# EasyEDA schematic SCH_N20电动螺丝刀_2022-09-17.json
TITLE: n20电动螺丝刀; REV: 0.1; Date: 2022-09-13; Sheet: 1/1; Drawn By: 0321cwb; Company: Your Company
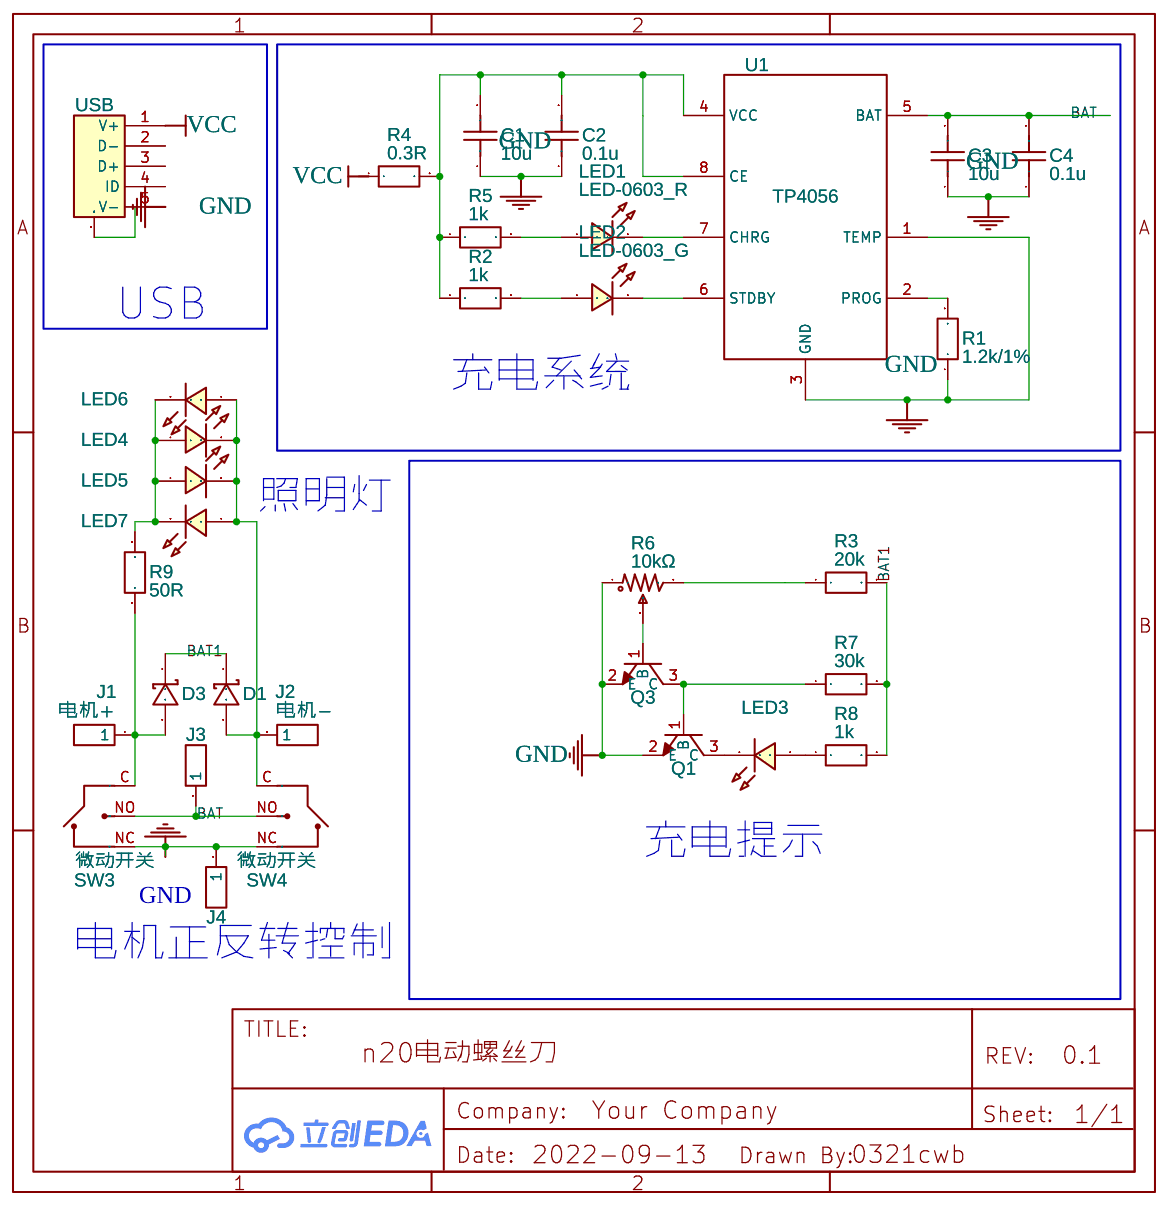
[diagram p0: schematic sheet]

## Parts
C1  10u  [C0603]
C2  0.1u  [C0603]
C3  10u  [C0603]
C4  0.1u  [C0603]
D1  1N5817WS  [SOD-323_L1.8-W1.3-LS2.5-RD]
D3  1N5817WS  [SOD-323_L1.8-W1.3-LS2.5-RD]
J1  电机+  [HDR-M-2.54_1X1]
J2  电机-  [HDR-M-2.54_1X1]
J3  HDR-M-2.54_1x1  [HDR-M-2.54_1X1]
J4  HDR-M-2.54_1x1  [HDR-M-2.54_1X1]
LED1  LED-0603_R  [LED0603_RED]
LED2  LED-0603_G  [LED0603_GREEN]
LED3  LED-0603_R  [LED0603_RED]
LED4  LED-0603_R  [LED0603_RED]
LED5  LED-0603_R  [LED0603_RED]
LED6  LED-0603_R  [LED0603_RED]
LED7  LED-0603_R  [LED0603_RED]
Q1  S8050_C2926165  [SOT-23-3_L2.9-W1.3-P1.90-LS2.4-BR]
Q3  S8050_C2926165  [SOT-23-3_L2.9-W1.3-P1.90-LS2.4-BR]
R1  1.2k/1%  [R0603]
R2  1k  [R0603]
R3  20k  [R0603]
R4  0.3R  [R0603]
R5  1k  [R0603]
R6  10kΩ  [RES-ADJ-SMD_3P-L3.0-W3.8-P1.75-BR]
R7  30k  [R0603]
R8  1k  [R0603]
R9  50R  [R0603]
SW3  微动开关  [SW-TH_DEALON_LF-108]
SW4  微动开关  [SW-TH_DEALON_LF-108]
U1  TP4056  [SOP8_150MIL_JX]
USB  micro 5PFour-legged board7.2There is a column card point0.4m  [MICRO-USB-SMD_5P-P0.65-H-F-C40943]

## Library data of the parts
C1-C4 = C_0603_US: Contributor: LCEDA_Lib
D1 D3 = 1N5817WS: Supplier: LCSC; Supplier Part: C489146; Manufacturer: KEXIN; Contributor: LCSC; JLCPCB Part Class: Extended Part
J1-J4 = HDR-M-2.54_1x1: Supplier Part: C81276; Supplier: LCSC; Contributor: LCEDA_Lib
LED1 LED3-LED7 = LED-0603_R: Manufacturer: EVERLIGHT(台湾亿光); Manufacturer Part: 19-217/R6C-AL1M2VY/3T; Supplier Part: C72044; Supplier: LCSC; Contributor: LCEDA_01
LED2 = LED-0603_G: Manufacturer: EVERLIGHT(台湾亿光); Manufacturer Part: 19-217/GHC-YR1S2/3T; Supplier Part: C72043; Supplier: LCSC; Contributor: LCEDA_Lib
Q1 Q3 = S8050_C2926165: Supplier: LCSC; Supplier Part: C2926165; Manufacturer: FOSAN(富信); Manufacturer Part: S8050; Contributor: LCSC; JLCPCB Part Class: Extended Part
R1-R5 R7-R9 = R_0603_EU: Contributor: LCEDA_Lib
R6 = TC33X-2-103E: Supplier: LCSC; Supplier Part: C719176; Manufacturer: BOURNS; Contributor: LCSC; JLCPCB Part Class: Extended Part
SW3 SW4 = LF-108: Supplier: LCSC; Supplier Part: C2914466; Manufacturer: DEALON(德艺隆); Contributor: LCSC
U1 = -: Supplier: LCSC
USB = micro 5PFour-legged board7.2There is a column card point0.4m: Supplier: LCSC; Manufacturer: ValuePro; image: //image.lceda.cn/szlcsc/C40943.jpg; Supplier Part: C40943

## Nets
GND: C1.1 C2.1 C3.1 C4.1 J4.1 Q1.2(E) Q3.2(E) R1.1 R6.1 SW3.NC SW4.NC U1.1(TEMP) U1.3(GND) USB.5(V-)
VCC: R4.1 USB.1(V+)
BAT: C3.2 C4.2 J3.1 SW3.NO SW4.NO U1.5(BAT)
BAT1: D1.1 D3.1 R3.2 R7.2 R8.2
Net-(C1-2): C1.2 C2.2 R2.1 R4.2 R5.1 U1.4(VCC) U1.8(CE)
Net-(D1-2): D1.2 J2.1 LED4.2 LED5.2 LED6.1 LED7.1 SW4.C
Net-(D3-2): D3.2 J1.1 R9.1 SW3.C
Net-(LED1-1): LED1.1 R5.2
Net-(LED1-2): LED1.2 U1.7(CHRG)
Net-(LED2-1): LED2.1 R2.2
Net-(LED2-2): LED2.2 U1.6(STDBY)
Net-(LED3-1): LED3.1 R8.1
Net-(LED3-2): LED3.2 Q1.3(C)
Net-(LED4-1): LED4.1 LED5.1 LED6.2 LED7.2 R9.2
Net-(Q1-1): Q1.1(B) Q3.3(C) R7.1
Net-(Q3-1): Q3.1(B) R6.2
Net-(R1-2): R1.2 U1.2(PROG)
Net-(R3-1): R3.1 R6.3

Not connected (* = marked no-connect by the designer): USB 0(MTN6) 2(D-) 3(D+) 4(ID)

## Notes on the sheet
- USB
- 充电系统
- 照明灯
- 充电提示
- 电机正反转控制
